# Altium schematic sheet 400_TEENSY.SchDoc: Thermal Logic Controller
size A; Revision: 1; SheetNumber: 1
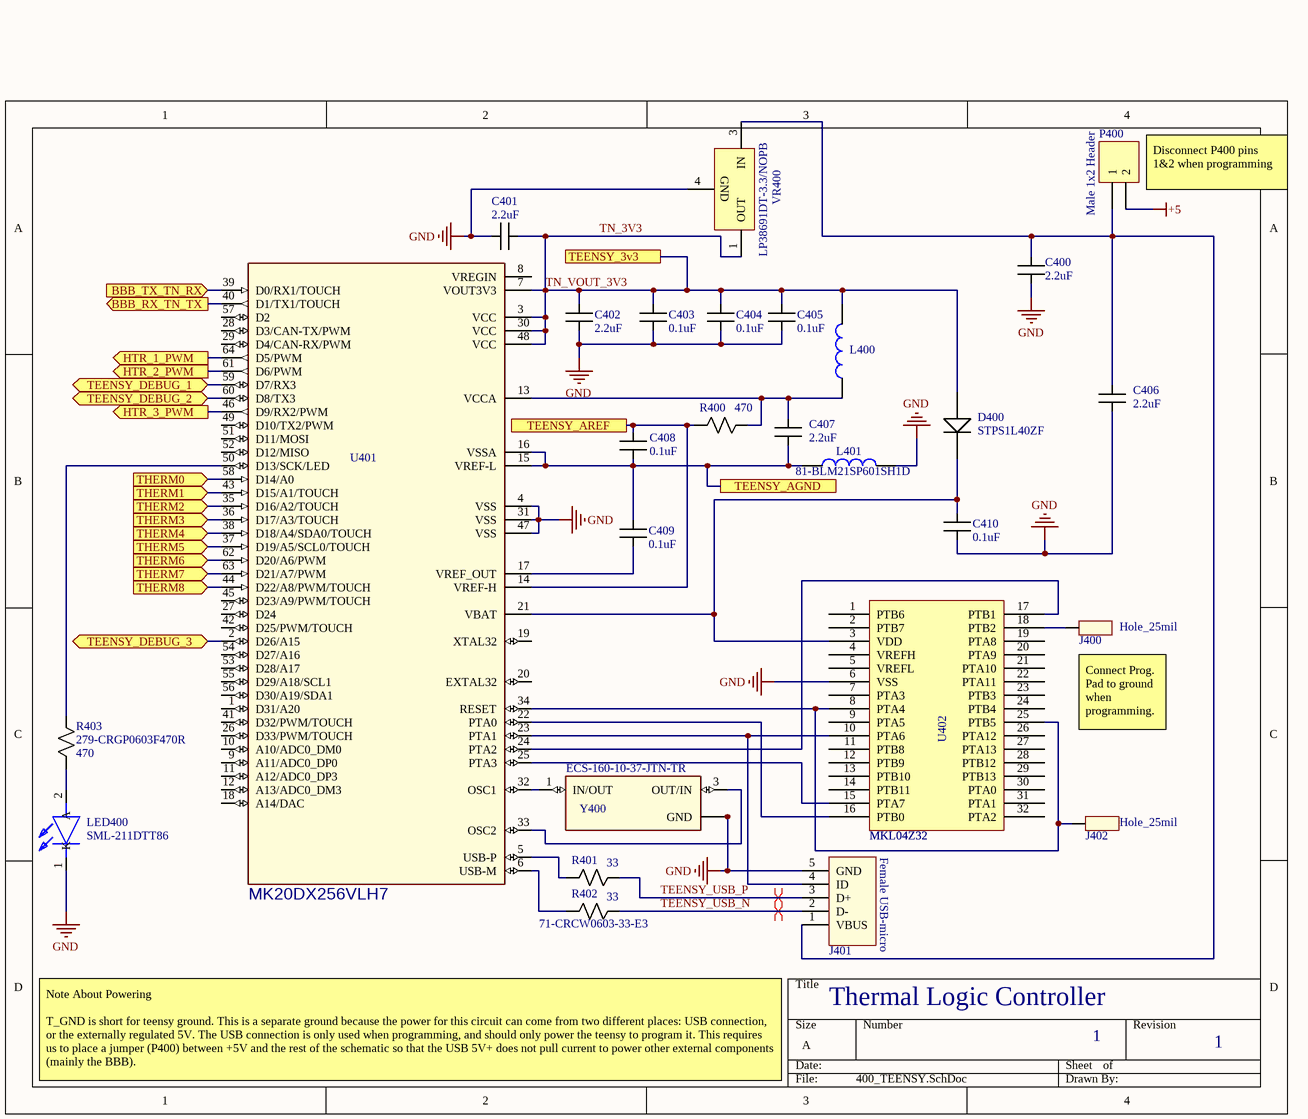
[diagram p0: 400_TEENSY.SchDoc]

## Parts
C400  value 2.2uF  [IMPERIAL0603_Capacitor]  (hidden comment: 2.2uF Capacitor)
C401  value 2.2uF  [IMPERIAL0603_Capacitor]  (hidden comment: 2.2uF Capacitor)
C402  value 2.2uF  [IMPERIAL0603_Capacitor]  (hidden comment: 2.2uF Capacitor)
C403  value 0.1uF  [IMPERIAL0603_Capacitor]  (hidden comment: 0.1uF Capactor)
C404  value 0.1uF  [IMPERIAL0603_Capacitor]  (hidden comment: 0.1uF Capactor)
C405  value 0.1uF  [IMPERIAL0603_Capacitor]  (hidden comment: 0.1uF Capactor)
C406  value 2.2uF  [IMPERIAL0603_Capacitor]  (hidden comment: 2.2uF Capacitor)
C407  value 2.2uF  [IMPERIAL0603_Capacitor]  (hidden comment: 2.2uF Capacitor)
C408  value 0.1uF  [IMPERIAL0603_Capacitor]  (hidden comment: 0.1uF Capactor)
C409  value 0.1uF  [IMPERIAL0603_Capacitor]  (hidden comment: 0.1uF Capactor)
C410  value 0.1uF  [IMPERIAL0603_Capacitor]  (hidden comment: 0.1uF Capactor)
D400  STPS1L40ZF  [*SODFL3718X108N]
J400  Hole_25mil  [PAD_40x25]
J401  uUSB Padsonly  [uUSB_Padsonly]  (value not drawn)
J402  Hole_25mil  [PAD_40x25]
L400  Supplier Part Number 1: 81-BLM21SP601SH1D  [Imperial0805_RES]  (hidden comment: Ferritde, 600 Ohm Impedence)
L401  Ferritde, 600 Ohm Impedence  [Imperial0805_RES]  (value not drawn)
LED400  SML-211DTT86  [LEDC2012X90N]
P400  Header 2  [HDR1X2]  (value not drawn)
R400  value 470  [Imperial0603_RES]  (hidden comment: 470 Ohm Resistor)
R401  value 33  [Imperial0603_RES]  (hidden comment: 33 Ohm Resistor)
R402  value 33  Supplier Part Number 1: 71-CRCW0603-33-E3  [Imperial0603_RES]  (hidden comment: 33 Ohm Resistor)
R403  value 470  Supplier Part Number 1: 279-CRGP0603F470R  [Imperial0603_RES]  (hidden comment: 470 Ohm Resistor)
U401  MK20DX256VLH7  [*QFP50P1200X1200X160-64N]
U402  MKL04Z32  [*QFP80P900X900X160-32N]
VR400  LP38691DT-3.3/NOPB  [NDP0003B_N]
Y400  ECS-160-10-37-JTN-TR  [XTAL_ECS-160-10-37-RWM-TR]

## Ports
BBB_RX_TN_TX (out), BBB_TX_TN_RX (in), HTR_1_PWM (out), HTR_2_PWM (out), HTR_3_PWM (out), TEENSY_3v3, TEENSY_AGND, TEENSY_AREF, TEENSY_DEBUG_1 (bidir), TEENSY_DEBUG_2 (bidir), TEENSY_DEBUG_3 (bidir), THERM0 (in), THERM1 (in), THERM2 (in), THERM3 (in), THERM4 (in), THERM5 (in), THERM6 (in), THERM7 (in), THERM8 (in)

## Nets
+5: P400.2
GND: C400.2 C401.2 C402.2 C403.2 C404.2 C405.2 C406.2 C410.2 J401.5(GND) L401.2 LED400.1(K) U401.4(VSS) U401.31(VSS) U401.47(VSS) U402.6(VSS) VR400.4(GND) Y400.2(GND) Y400.4(GND)
BBB_RX_TN_TX: U401.40(D1/TX1/TOUCH) ; port BBB_RX_TN_TX
BBB_TX_TN_RX: U401.39(D0/RX1/TOUCH) ; port BBB_TX_TN_RX
HTR_1_PWM: U401.64(D5/PWM) ; port HTR_1_PWM
HTR_2_PWM: U401.61(D6/PWM) ; port HTR_2_PWM
HTR_3_PWM: U401.46(D9/RX2/PWM) ; port HTR_3_PWM
TEENSY_AGND: C407.2 C408.2 C409.1 L401.1 U401.15(VREF-L) U401.16(VSSA) ; port TEENSY_AGND
TEENSY_AREF: C408.1 R400.1 U401.14(VREF-H) ; port TEENSY_AREF
TEENSY_DEBUG_1: U401.59(D7/RX3) ; port TEENSY_DEBUG_1
TEENSY_DEBUG_2: U401.60(D8/TX3) ; port TEENSY_DEBUG_2
TEENSY_DEBUG_3: U401.2(D26/A15) ; port TEENSY_DEBUG_3
TEENSY_USB_N: J401.2(D-) R402.2
TEENSY_USB_P: J401.3(D+) R401.2
THERM0: U401.58(D14/A0) ; port THERM0
THERM1: U401.43(D15/A1/TOUCH) ; port THERM1
THERM2: U401.35(D16/A2/TOUCH) ; port THERM2
THERM3: U401.36(D17/A3/TOUCH) ; port THERM3
THERM4: U401.38(D18/A4/SDA0/TOUCH) ; port THERM4
THERM5: U401.37(D19/A5/SCL0/TOUCH) ; port THERM5
THERM6: U401.62(D20/A6/PWM) ; port THERM6
THERM7: U401.63(D21/A7/PWM) ; port THERM7
THERM8: U401.44(D22/A8/PWM/TOUCH) ; port THERM8
TN_3V3: C401.1 C402.1 C403.1 C404.1 C405.1 D400.2(anode) L400.2 U401.3(VCC) U401.7(VOUT3V3) U401.30(VCC) U401.48(VCC) VR400.1(OUT) ; port TEENSY_3v3  [also labelled TN_VOUT_3V3]
NetC400_1: C400.1 C406.1 J401.1(VBUS) P400.1 VR400.3(IN)
NetC407_1: C407.1 L400.1 R400.2 U401.13(VCCA)
NetC409_2: C409.2 U401.17(VREF_OUT)
NetC410_1: C410.1 D400.1(cathode) U401.21(VBAT) U402.3(VDD)
NetJ400_1: J400.1(PIN) U402.18(PTB2)
NetJ401_4: J401.4(ID) U401.23(PTA1) U402.10(PTA6)
NetJ402_1: J402.1(PIN) U401.34(RESET) U402.8(PTA4) U402.25(PTB5)
NetLED400_2: LED400.2(A) R403.1
NetR401_1: R401.1 U401.5(USB-P)
NetR402_1: R402.1 U401.6(USB-M)
NetR403_2: R403.2 U401.50(D13/SCK/LED)
NetU401_22: U401.22(PTA0) U402.16(PTB0)
NetU401_24: U401.24(PTA2) U402.17(PTB1)
NetU401_25: U401.25(PTA3) U402.15(PTA7)
NetU401_32: U401.32(OSC1) Y400.1(IN/OUT)
NetU401_33: U401.33(OSC2) Y400.3(OUT/IN)

Not connected (* = marked no-connect by the designer): U401 1(D31/A20) 8(VREGIN) 9(A11/ADC0_DP0) 10(A10/ADC0_DM0) 11(A12/ADC0_DP3) 12(A13/ADC0_DM3) 18(A14/DAC) 19(XTAL32) 20(EXTAL32) 26(D33/PWM/TOUCH) 27(D24) 28(D3/CAN-TX/PWM) 29(D4/CAN-RX/PWM) 41(D32/PWM/TOUCH) 42(D25/PWM/TOUCH) 45(D23/A9/PWM/TOUCH) 49(D10/TX2/PWM) 51(D11/MOSI) 52(D12/MISO) 53(D28/A17) 54(D27/A16) 55(D29/A18/SCL1) 56(D30/A19/SDA1) 57(D2); U402 1(PTB6) 2(PTB7) 4(VREFH) 5(VREFL) 7(PTA3) 9(PTA5) 11(PTB8) 12(PTB9) 13(PTB10) 14(PTB11) 19(PTA8) 20(PTA9) 21(PTA10) 22(PTA11) 23(PTB3) 24(PTB4) 26(PTA12) 27(PTA13) 28(PTB12) 29(PTB13) 30(PTA0) 31(PTA1) 32(PTA2)

## Layout directives
differential pair; rule Impedance Constraint [Min = 40.50    Max = 49.50    ]: TEENSY_USB_N, TEENSY_USB_P

## Notes on the sheet
- (near P400) Disconnect P400 pins 1&2 when programming
- (near P400) Male 1x2 Header
- (near J400) Connect Prog. Pad to ground when programming.
- Female USB-micro
- Note About Powering
  T_GND is short for teensy ground. This is a separate ground because the power for this circuit can come from two different places: USB connection, or the externally regulated 5V. The USB connection is only used when programming, and should only power the teensy to program it. This requires us to place a jumper (P400) between +5V and the rest of the schematic so that the USB 5V+ does not pull current to power other external components (mainly the BBB).

## Library data of the parts
C400-C402 C406 C407 = LMK107BJ225KK-T: 2.2uF Capacitor, Non Polarized Chip Cap; Supplier 1: Mouser; Supplier Part Number 1: 963-LMK107BJ225KK-T
C403-C405 C408-C410 = TMK107BJ104KA-T: 0.1uF capacitor, Non Polarized Chip Cap; Supplier 1: Mouser; Supplier Part Number 1: 963-TMK107BJ104KA-T
D400 = STPS1L40ZF: 1A Schottky Diode; pin to pad: 1>C 2>A; Supplier 1: Mouser; Supplier Part Number 1: 511-STPS1L40ZF
J400 J402 = Hole_25mil: 40 mil solder pad - 25 mil hole; Value: DNI
J401 = uUSB_Padsonly: Micro USB Connection - solder pads only; Value: DNI; Supplier 1: Mouser; Supplier Part Number 1: 710-629105150921
L400 L401 = BLM21SP601SH1D: Ferrite Bead, 600 Ohm Impedence for TLC; Value: 600 Ohm; Supplier 1: Mouser
  L401: Supplier Part Number 1: 81-BLM21SP601SH1D
LED400 = SML-211DTT86: LED; Manufacturer_Name: ROHM Semiconductor; Height: 0.9mm; Manufacturer_Part_Number: SML-211DTT86
P400 = Header 2: Header, 2-Pin; LatestRevisionDate: 17-Jul-2002; LatestRevisionNote: Re-released for DXP Platform.; Publisher: Altium Limited
R400 R403 = CRGP0603F470R: 470 Ohm Generic Chip Resistor; Supplier 1: Mouser
  R400: Supplier Part Number 1: 279-CRGP0603F470R
R401 R402 = CRCW060333R0FKEAC: 33 Ohm Generic Chip Resistor; Supplier 1: Mouser
  R401: Supplier Part Number 1: 71-CRCW0603-33-E3
U401 = MK20DX256VLH7: MCU 32-bit Kinetis K20 ARM Cortex M4 RISC 256KB Flash 1.8V/2.5V/3.3V 64-Pin LQFP Tray; MF: NXP USA; Package: LQFP-64 Freescale Semiconductor; Price: None; MP: MK20DX256VLH7; Availability: Unavailable; SnapEDA_Link: https://www.snapeda.com/parts/MK20DX256VLH7/NXP%20USA%20Inc./view-part/?ref=snap; Value: *; Supplier 1: Mouser; Supplier Part Number 1: 841-MK20DX256VLH7
U402 = MKL04Z32: Bootloader chip for teensy 3.2; Part Number: MKL04Z32
VR400 = CMP-0062-00443-4: 3.3V 500mA Low Dropout CMOS Linear Regulators Stable with Ceramic Output Capacitors, 3-pin TO-252, Pb-Free, 75 Rail; Manufacturer: Texas Instruments; CompType: LDO IC; PowerWise: Y; PackageTopMarking: NSUZXYTT*LP38691*DT-3.3; PackageDescription: TO252, Molded, Jedec, 6.8 x 6.10 x 2.30mm Body, 3 Lead, 2.28mm Pitch, Surface Mount; PackageReference: NDP0003B; ComponentLink1Description: Datasheet URL; RoHS: Y; PartNumber: LP38691DT-3.3/NOPB; PinCount: 3; ComponentLink1URL: http://www.ti.com/general/docs/lit/getliterature.tsp?genericPartNumber=LP38691&fileType=pdf; Code_JEDEC: TO-252-AA; High-Reliability: Y
Y400 = ECS-160-10-37-JTN-TR: Crystal 16MHz; MF: ECS Inc.; Package: SMD-4 ECS International; MP: ECS-160-10-37-JTN-TR; Digi-Key_Purchase_URL: https://www.digikey.com/product-detail/en/ecs-inc/ECS-160-10-37-RWM-TR/XC2119CT-ND/5875603?utm_source=snapeda&utm_medium=aggregator&utm_campaign=symbol; Digi-Key_Part_Number: XC2119CT-ND; SnapEDA_Link: https://www.snapeda.com/parts/ECS-160-10-37-RWM-TR/ECS%20Inc./view-part/?ref=snap; Value: *; Supplier 1: Mouser; Supplier Part Number 1: 520-160-10-37-RWM-T